# EAGLE design Sensor LF V.2C (EAGLE 7.2.0)
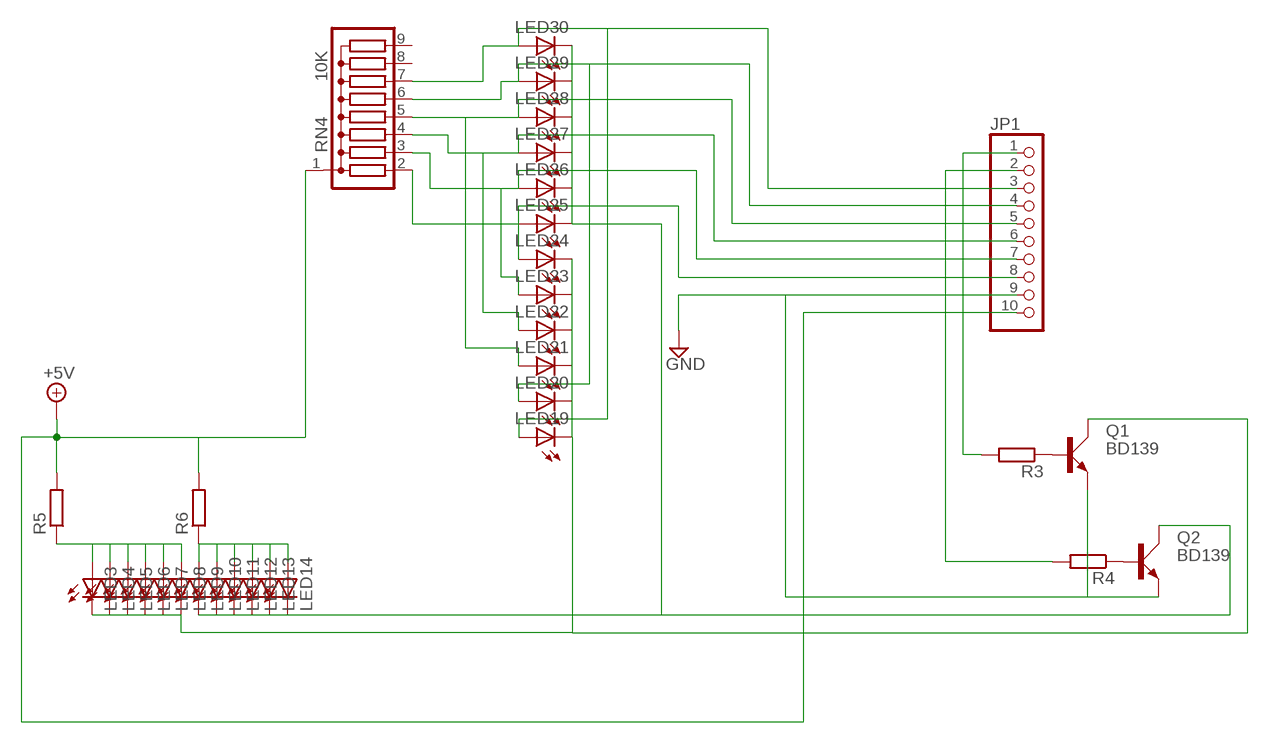
[diagram p0: schematic, sheet 1]

## Parts
JP1  PINHD-1X10  [1X10]
LED3  LED3MM  [LED3MM]
LED4  LED3MM  [LED3MM]
LED5  LED3MM  [LED3MM]
LED6  LED3MM  [LED3MM]
LED7  LED3MM  [LED3MM]
LED8  LED3MM  [LED3MM]
LED9  LED3MM  [LED3MM]
LED10  LED3MM  [LED3MM]
LED11  LED3MM  [LED3MM]
LED12  LED3MM  [LED3MM]
LED13  LED3MM  [LED3MM]
LED14  LED3MM  [LED3MM]
LED19  LED3MM  [LED3MM]
LED20  LED3MM  [LED3MM]
LED21  LED3MM  [LED3MM]
LED22  LED3MM  [LED3MM]
LED23  LED3MM  [LED3MM]
LED24  LED3MM  [LED3MM]
LED25  LED3MM  [LED3MM]
LED26  LED3MM  [LED3MM]
LED27  LED3MM  [LED3MM]
LED28  LED3MM  [LED3MM]
LED29  LED3MM  [LED3MM]
LED30  LED3MM  [LED3MM]
Q1  BD139  [TO126AV]
Q2  BD139  [TO126AV]
R3  R-EU_0204/7  [0204/7]
R4  R-EU_0204/7  [0204/7]
R5  R-EU_0204/7  [0204/7]
R6  R-EU_0204/7  [0204/7]
RN4  10K  G08R  [SIL9]

## Nets
+5V: JP1.10 R5.2 R6.2 RN4.1
GND: JP1.9 Q1.E Q2.E
N$2: Q2.B R4.1
N$4: LED9.K(C) LED10.K(C) LED11.K(C) LED12.K(C) LED13.K(C) LED14.K(C) LED25.K(C) LED26.K(C) LED27.K(C) LED28.K(C) LED29.K(C) LED30.K(C) Q2.C
N$5: LED3.K(C) LED4.K(C) LED5.K(C) LED6.K(C) LED7.K(C) LED8.K(C) LED19.K(C) LED20.K(C) LED21.K(C) LED22.K(C) LED23.K(C) LED24.K(C) Q1.C
N$15: JP1.2 R4.2
N$16: JP1.1 R3.2
N$25: JP1.8 LED24.A LED25.A RN4.2
N$26: JP1.7 LED23.A LED26.A RN4.3
N$27: JP1.6 LED22.A LED27.A RN4.4
N$28: JP1.5 LED21.A LED28.A RN4.5
N$29: JP1.4 LED20.A LED29.A RN4.6
N$30: JP1.3 LED19.A LED30.A RN4.7
N$31: Q1.B R3.1
N$33: LED3.A LED4.A LED5.A LED6.A LED7.A LED8.A R5.1
N$39: LED9.A LED10.A LED11.A LED12.A LED13.A LED14.A R6.1
Unconnected: RN4.8 RN4.9

## Library data of the parts
JP1 = pinhead:PINHD-1X10: PIN HEADER
LED3-LED14 LED19-LED30 = led:LED: LED OSRAM: - CHIPLED LG R971, LG N971, LY N971, LG Q971, LY Q971, LO R971, LY R971 LH N974, LH R974 LS Q976, LO Q976, LY Q976 LO Q996 - Hyper CHIPLED LW Q18S LB Q993, LB Q99A, LB R99A - SideLED LS A670, LO A670, LY A670, LG A670, LP A670 LB A673, LV A673, LT A673, LW A673 LH A674 LY A675 LS A676, LA A676, LO A676, LY A676, LW A676 LS A679, LY A679, LG A679 - Hyper Micro SIDELED® LS Y876, LA Y876, LO Y876, LY Y876 LT Y87S - SmartLED LW L88C, LW L88S LB L89C, LB L89S, LG L890 LS L89K, LO L89K, LY L89K LS L896, LA L896, LO L896, LY L896 - TOPLED LS T670, LO T670, LY T670, LG T670, LP T670 LSG T670, LSP T670, LSY T670, LOP T670, LYG T670 LG T671, LOG T671, LSG T671 LB T673, LV T673, LT T673, LW T673 LH T674 LS T676, LA T676, LO T676, LY T676, LB T676, LH T676, LSB T676, LW T676 LB T67C, LV T67C, LT T67C, LS T67K, LO T67K, LY T67K, LW E67C LS E67B, LA E67B, LO E67B, LY E67B, LB E67C, LV E67C, LT E67C LW T67C LS T679, LY T679, LG T679 LS T770, LO T770, LY T770, LG T770, LP T770 LB T773, LV T773, LT T773, LW T773 LH T774 LS E675, LA E675, LY E675, LS T675 LS T776, LA T776, LO T776, LY T776, LB T776 LHGB T686 LT T68C, LB T68C - Hyper Mini TOPLED® LB M676 - Mini TOPLED Santana® LG M470 LS M47K, LO M47K, LY M47K Source: http://www.osram.convergy.de LUXEON: - LUMILED® LXK2-PW12-R00, LXK2-PW12-S00, LXK2-PW14-U00, LXK2-PW14-V00 LXK2-PM12-R00, LXK2-PM12-S00, LXK2-PM14-U00 LXK2-PE12-Q00, LXK2-PE12-R00, LXK2-PE12-S00, LXK2-PE14-T00, LXK2-PE14-U00 LXK2-PB12-K00, LXK2-PB12-L00, LXK2-PB12-M00, LXK2-PB14-N00, LXK2-PB14-P00, LXK2-PB14-Q00 LXK2-PR12-L00, LXK2-PR12-M00, LXK2-PR14-Q00, LXK2-PR14-R00 LXK2-PD12-Q00, LXK2-PD12-R00, LXK2-PD12-S00 LXK2-PH12-R00, LXK2-PH12-S00 LXK2-PL12-P00, LXK2-PL12-Q00, LXK2-PL12-R00 Source: www.luxeon.com KINGBRIGHT: KA-3528ASYC Source: www.kingbright.com
Q1 Q2 = transistor-power:BD139: NPN TRANSISTOR
R3-R6 = resistor:R-EU_: RESISTOR, European symbol
RN4 = resistor-sil:G08R: SIL RESISTOR

## Net classes
0 default: width 0.051 mm, clearance 0.051 mm

## Board
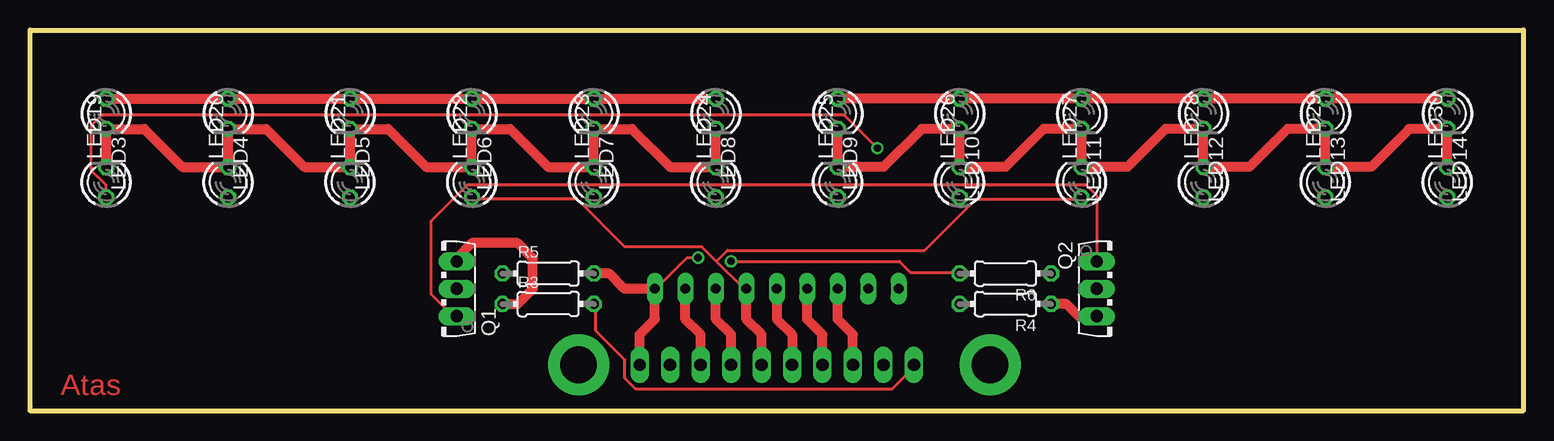
[diagram p1: board, top side]
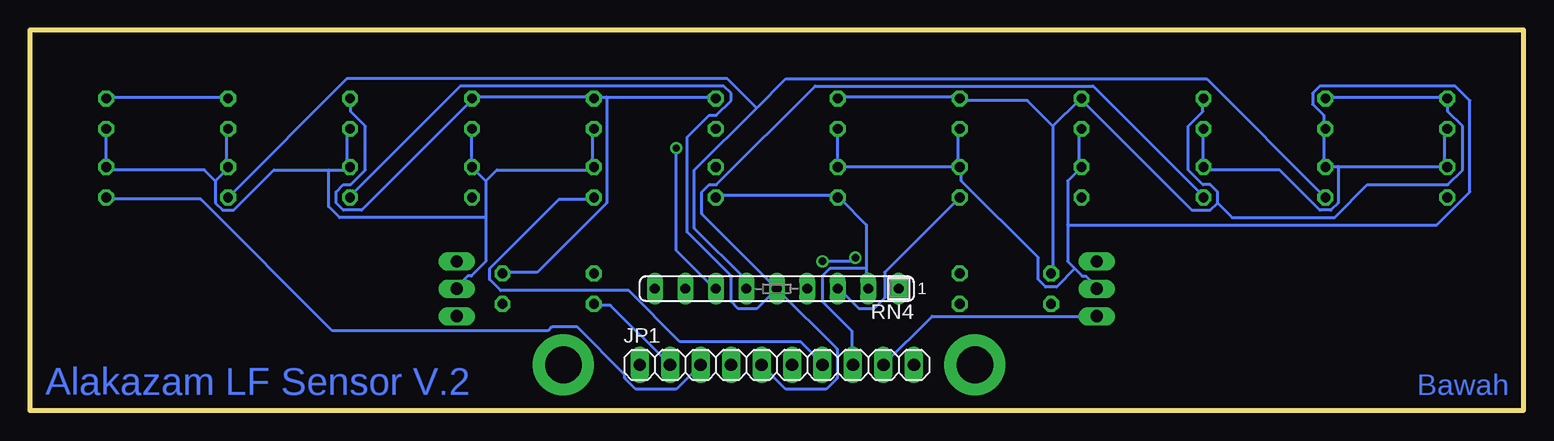
[diagram p2: board, bottom side, seen from below]

Size 124.46 x 31.75 mm. Coordinates in mm from the lower left corner, seen from the top.
Outline: 0,0 0,31.75 124.46,31.75 124.46,0 0,0
Copper layers (1*16): Top 0.035mm / dielectric 1.5mm / Bottom 0.035mm
Design rules "default": minimum track width 10mil, minimum drill 24mil, track to track 8mil, track to pad 8mil, pad to pad 8mil, via to via 8mil, smd to smd 8mil, copper to edge 40mil, drill to drill 8mil, minimum pad ring 10mil, minimum via ring 8mil, stop-mask expansion 4mil, vias tented up to drill 0mil, thermal gap 10mil

### Footprints (pad centres in the part's own frame; a part is rotated, then mirrored left to right if it is on the bottom)
1X10 = drill 1.016 long: 1 -11.43,0; 2 -8.89,0; 3 -6.35,0; 4 -3.81,0; 5 -1.27,0; 6 1.27,0; 7 3.81,0; 8 6.35,0; 9 8.89,0; 10 11.43,0
LED3MM = drill 0.813 octagon: A -1.27,0; K 1.27,0
TO126AV = drill 1.016 long: B 2.286,-1.27; C 0,-1.27; E -2.286,-1.27
0204/7 = drill 0.813 octagon: 1 -3.81,0; 2 3.81,0
SIL9 = drill 0.813 long: 1 -10.16,0; 2 -7.62,0; 3 -5.08,0; 4 -2.54,0; 5 0,0; 6 2.54,0; 7 5.08,0; 8 7.62,0; 9 10.16,0

### Placement (x,y rotation side)
JP1  62.23,3.81 0 bottom
LED3  6.35,24.77 270 top
LED4  16.51,24.77 270 top
LED5  26.67,24.77 270 top
LED6  36.83,24.77 270 top
LED7  46.99,24.77 270 top
LED8  57.15,24.77 270 top
LED9  67.31,24.77 270 top
LED10  77.47,24.77 270 top
LED11  87.63,24.77 270 top
LED12  97.79,24.77 270 top
LED13  107.95,24.77 270 top
LED14  118.11,24.77 270 top
LED19  6.35,19.05 90 top
LED20  16.51,19.05 90 top
LED21  26.67,19.05 90 top
LED22  36.83,19.05 90 top
LED23  46.99,19.05 90 top
LED24  57.15,19.05 90 top
LED25  67.31,19.05 90 top
LED26  77.47,19.05 90 top
LED27  87.63,19.05 90 top
LED28  97.79,19.05 90 top
LED29  107.95,19.05 90 top
LED30  118.11,19.05 90 top
Q1  34.29,10.16 90 top
Q2  90.17,10.16 270 top
R3  43.18,8.89 0 top
R4  81.28,8.89 180 top
R5  43.18,11.43 0 top
R6  81.28,11.43 180 top
RN4  62.23,10.16 180 bottom

### Tracks (layer width: path | path; a pad name or v marks a point on that pad's centre or on a via)
+5V  (via drill 0.61)
  Top 0.254: v58.42,12.45 72.44,12.45 73.36,11.53 77.32,11.53 R6.2 | v55.68,12.75 54.76,12.75 52.32,10.31 RN4.1
  Top 0.813: JP1.10 50.8,6.35 52.07,7.62 RN4.1 49.53,10.16 48.26,11.43 R5.2
  Bottom 0.254: v58.42,12.45 55.98,12.45 v55.68,12.75
GND
  Top 0.254: Q2.E 88.9,17.93 87.99,18.85 36.47,18.85 33.43,15.8 33.43,9.7 35.25,7.87 Q1.E
  Bottom 0.254: Q1.E 49.28,7.87 JP1.9
N$2
  Top 0.813: Q2.B 87.38,7.87 86.36,8.89 R4.1
N$4
  Top 0.813: LED30.K LED14.K 114.94,23.5 111.76,20.32 LED29.K LED13.K 104.78,23.5 101.6,20.32 LED28.K LED12.K 94.61,23.5 91.44,20.32 LED27.K LED11.K 84.45,23.5 81.28,20.32 LED26.K LED10.K 74.3,23.5 71.12,20.32 LED25.K LED9.K
  Bottom 0.254: LED14.K 118.16,23.42 118.16,20.37 LED30.K 117.86,20.07 109.93,20.07 109.02,19.15 | LED12.K 98.04,23.42 98.04,20.37 LED28.K 98.04,20.07 99.57,20.07 | LED13.K 108.1,23.42 108.1,20.37 LED29.K 108.1,20.07 109.02,19.15 | 99.57,20.07 104.14,20.07 107.49,16.71 108.41,16.71 109.02,17.32 109.02,19.15 | LED10.K 77.62,23.42 77.62,20.37 LED26.K 77.62,20.07 85.55,20.07 86.46,19.15 | LED11.K 87.68,23.42 87.68,20.37 LED27.K 86.46,19.15 | 86.46,19.15 86.46,16.1 | 86.46,16.1 86.46,12.45 87.68,11.23 87.99,11.23 88.9,10.31 Q2.C | 99.57,20.07 99.57,17.02 98.65,16.1 86.46,16.1
N$5
  Top 0.813: LED19.K LED3.K 9.52,23.5 12.7,20.32 LED20.K LED4.K 19.69,23.5 22.86,20.32 LED21.K LED5.K 29.84,23.5 33.02,20.32 LED22.K LED6.K 40,23.5 43.18,20.32 LED23.K LED7.K 50.16,23.5 53.34,20.32 LED24.K LED8.K
  Bottom 0.254: LED5.K 26.72,23.42 26.72,20.37 LED21.K 26.42,20.07 20.32,20.07 16.97,16.71 16.05,16.71 15.44,17.32 15.44,20.37 | 6.6,20.37 6.6,23.42 LED3.K | 15.44,20.37 16.36,20.37 LED20.K 16.66,20.37 16.66,23.42 LED4.K 16.66,23.72 16.66,24.64 17.58,25.55 17.58,26.47 16.97,27.08 5.69,27.08 4.47,25.86 4.47,18.24 7.21,15.49 38,15.49 | 15.44,20.37 6.6,20.37 | 6.6,20.37 LED19.K | 47.14,20.37 47.14,23.42 LED7.K | LED8.K 57.2,23.42 57.2,20.37 LED24.K 56.9,20.37 47.14,20.37 | 47.14,20.37 LED23.K 46.84,20.07 46.84,19.15 40.44,12.75 40.44,10.92 39.83,10.31 38.91,10.31 37.39,11.84 | LED6.K 37.08,23.42 37.08,20.37 LED22.K 38,19.15 38,15.49 | 37.39,11.84 38,12.45 38,15.49 | 37.39,11.84 36.78,11.23 36.47,11.23 35.56,10.31 Q1.C
N$7  (via drill 3.05 pad 5.08)
  other vias: 45.72,3.81
N$8  (via drill 3.05 pad 5.08)
  other vias: 80.01,3.81
N$15
  Bottom 0.254: JP1.2 76.1,8.79 77.32,8.79 R4.2
N$16
  Top 0.254: R3.2 47.14,8.79 47.14,6.66 49.58,4.22 49.58,2.69 50.5,1.78 71.83,1.78 73.66,3.61 JP1.1
N$25
  Top 0.813: JP1.8 55.88,6.35 54.61,7.62 RN4.2
  Bottom 0.254: 54.76,11.84 54.76,15.49 56.9,17.63 LED24.A 57.2,17.93 67.26,17.93 LED25.A | 54.76,11.84 54.76,10.31 RN4.2 | 54.76,11.84 57.81,11.84 58.42,11.23 58.42,9.09 55.98,6.66 55.98,3.91 JP1.8
N$26
  Top 0.813: JP1.7 58.42,6.35 57.15,7.62 RN4.3
  Bottom 0.254: LED26.A 77.62,17.63 80.37,17.63 86.16,11.84 86.16,10.92 85.24,10.01 74.57,10.01 70.31,5.74 60.25,5.74 58.42,3.91 JP1.7 | LED23.A 53.24,11.53 53.24,9.4 54.15,8.48 55.37,8.48 56.9,10.01 RN4.3
N$27
  Top 0.254: 57.2,12.45 59.33,10.31 RN4.4 | 57.2,12.45 55.98,13.67 49.58,13.67 45.62,17.63 37.08,17.63 LED22.A | 57.2,12.45 58.11,13.36 74.57,13.36 78.84,17.63 87.38,17.63 LED27.A
  Top 0.813: JP1.6 60.96,6.35 59.69,7.62 RN4.4
N$28
  Top 0.813: RN4.5 62.23,7.62 63.5,6.35 JP1.5
  Bottom 0.254: RN4.5 68.48,16.41 68.48,18.24 67.87,18.85 67.26,18.85 59.03,27.08 35.87,27.08 26.72,17.93 LED21.A | RN4.5 63.91,8.48 65.43,8.48 66.04,9.09 66.04,11.23 69.7,14.88 69.7,22.81 67.87,24.64 67.26,24.64 66.04,25.86 66.04,26.47 66.65,27.08 88.59,27.08 97.74,17.93 LED28.A | JP1.5 61.47,1.78 58.11,1.78 57.2,2.69 57.2,5.13 RN4.5
N$29
  Top 0.813: JP1.4 66.04,6.35 64.77,7.62 RN4.6
  Bottom 0.254: LED20.A 26.42,27.69 61.47,27.69 63.91,25.25 | 63.91,25.25 69.09,20.07 69.09,15.19 64.82,10.92 64.82,10.31 RN4.6 | LED29.A 98.04,27.69 66.34,27.69 63.91,25.25
N$30  (via drill 0.61)
  Top 0.254: v70.61,21.89 67.87,24.64 5.99,24.64 5.08,23.72 5.08,20.07 6.3,18.85 6.3,17.93 LED19.A
  Top 0.813: JP1.3 68.58,6.35 67.31,7.62 RN4.7
  Bottom 0.254: JP1.3 70.61,1.78 73.97,1.78 74.88,2.69 74.88,3 78.84,6.96 80.97,6.96 81.28,6.66 99.26,6.66 110.24,17.63 117.86,17.63 LED30.A | v70.61,21.89 70.61,13.36 67.56,10.31 RN4.7
N$31
  Top 0.813: R3.1 40.64,8.89 41.91,10.16 41.91,12.7 40.64,13.97 36.83,13.97 35.56,12.7 Q1.B
N$33
  Top 0.813: LED3.A LED4.A LED5.A LED6.A LED7.A LED8.A
  Bottom 0.254: LED4.A 16.36,26.16 6.6,26.16 LED3.A 6.3,25.86 6.3,24.94 5.08,23.72 5.08,20.07 6.3,18.85 13,18.85 15.75,16.1 24.28,16.1 25.5,17.32 | 25.5,17.32 25.5,18.24 26.11,18.85 26.72,18.85 27.94,20.07 27.94,23.72 26.72,24.94 26.72,25.86 LED5.A | 25.5,17.32 26.11,16.71 27.63,16.71 36.78,25.86 LED6.A 37.08,25.86 39.22,23.72 | 39.22,23.72 39.22,11.53 R5.1 | 39.22,23.72 41.35,25.86 46.84,25.86 LED7.A 47.14,26.16 56.9,26.16 LED8.A
N$39
  Top 0.813: LED14.A LED13.A LED12.A LED11.A LED10.A LED9.A
  Bottom 0.254: LED13.A 108.1,26.16 117.86,26.16 LED14.A | 76.4,26.16 77.32,26.16 LED10.A 77.62,26.16 87.38,26.16 LED11.A 87.68,25.86 96.83,16.71 98.35,16.71 98.96,17.32 98.96,18.24 98.35,18.85 97.74,18.85 96.52,20.07 96.52,23.72 97.74,24.94 97.74,25.86 LED12.A | 76.4,26.16 67.56,26.16 LED9.A | 76.4,26.16 76.4,17.32 82.19,11.53 84.94,11.53 R6.1

### Text on the board
Top: Atas
Bottom: Bawah | Alakazam LF Sensor V.2